# EAGLE schematic FrequencyCounter (EAGLE 7.2.0)
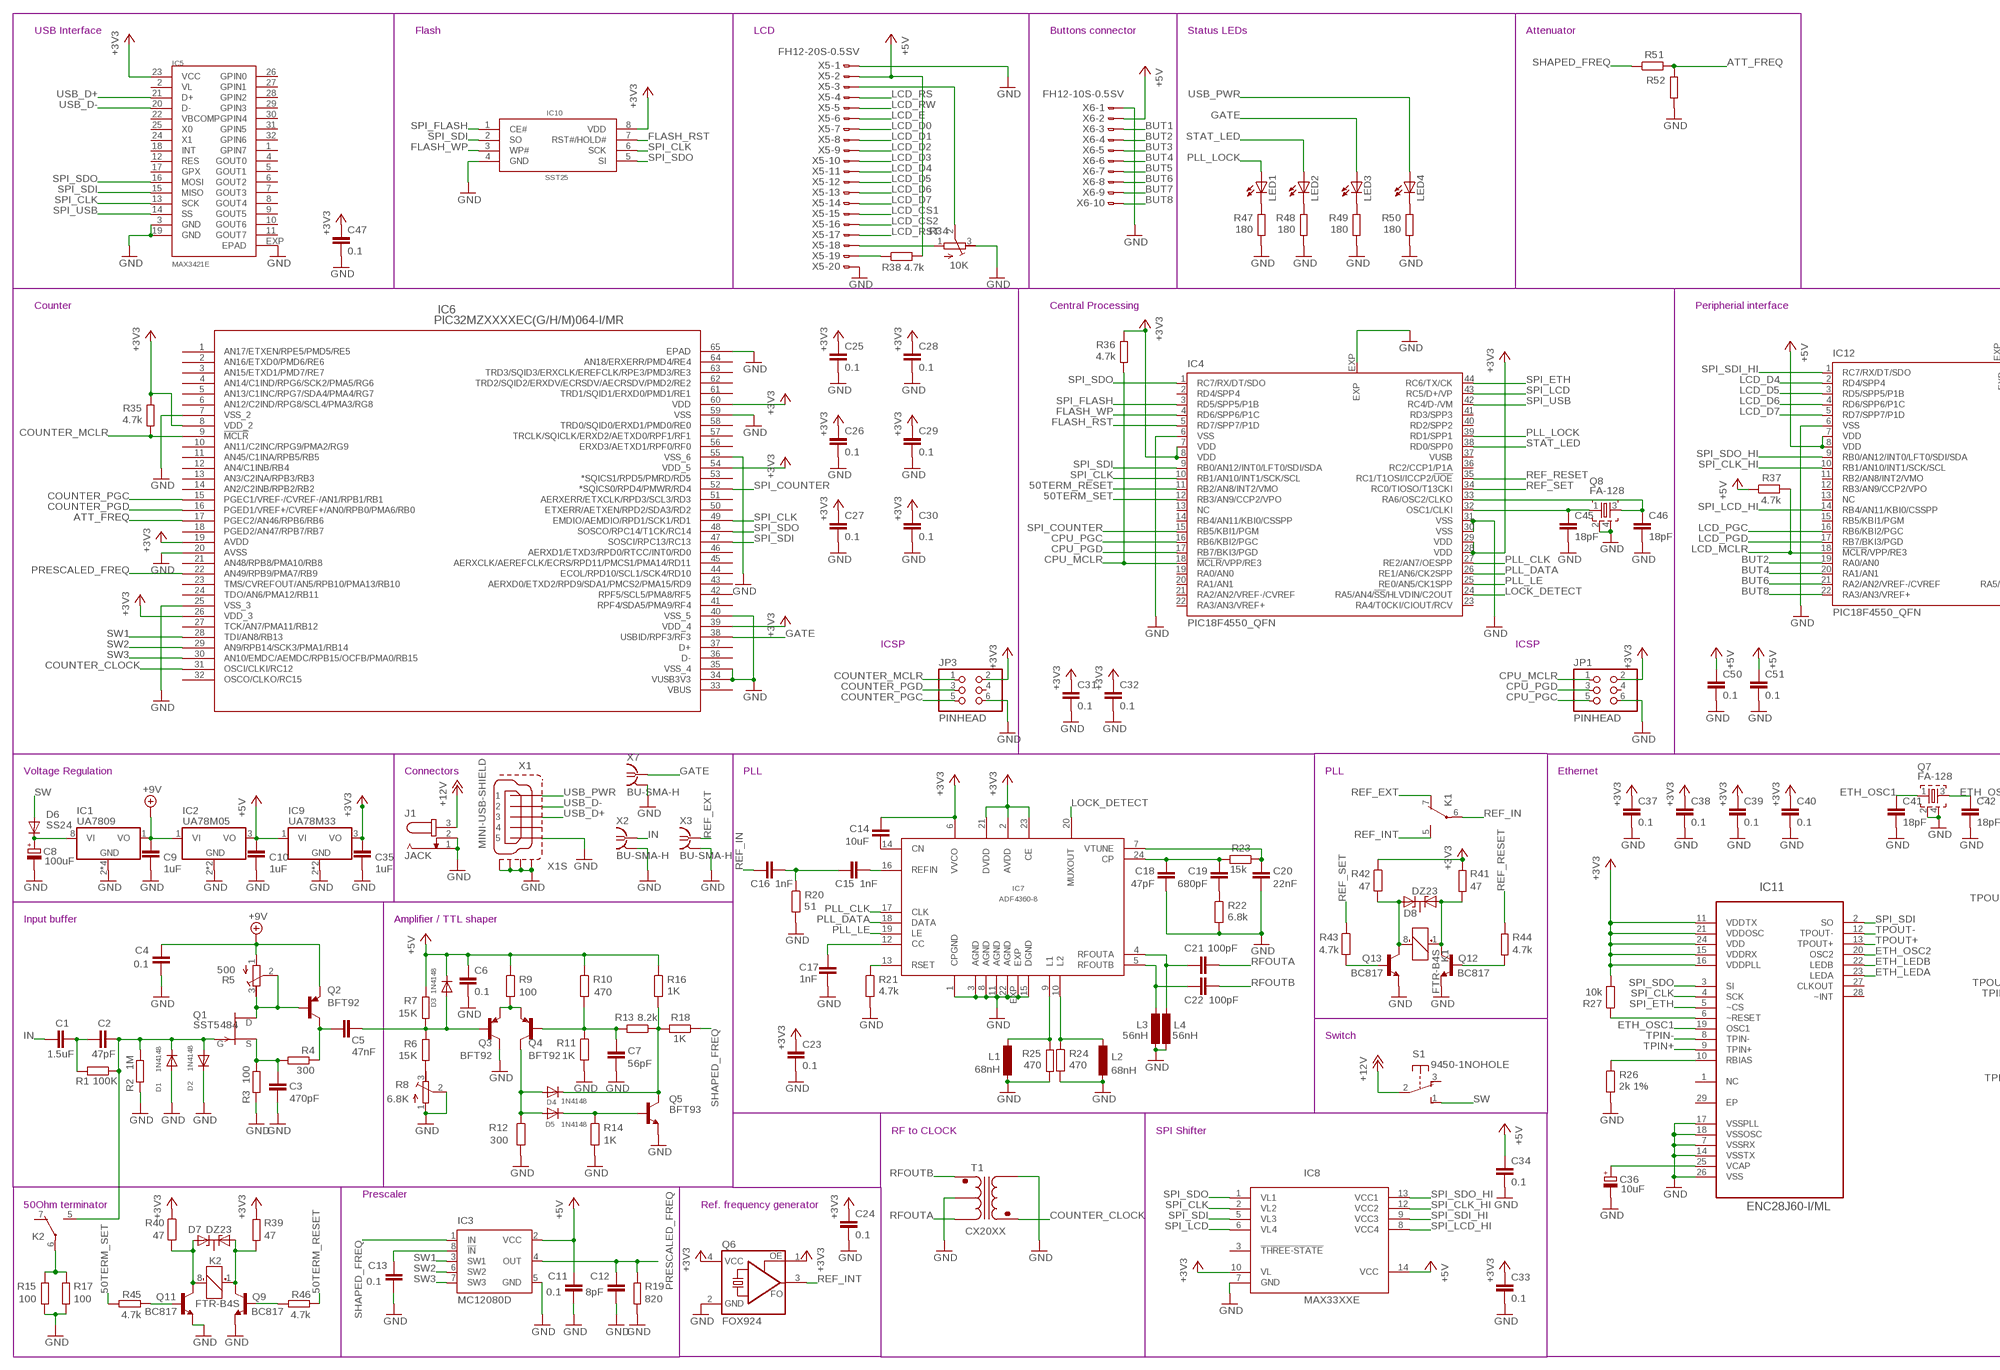
[diagram p0: schematic, sheet 1, part 1 of 2]
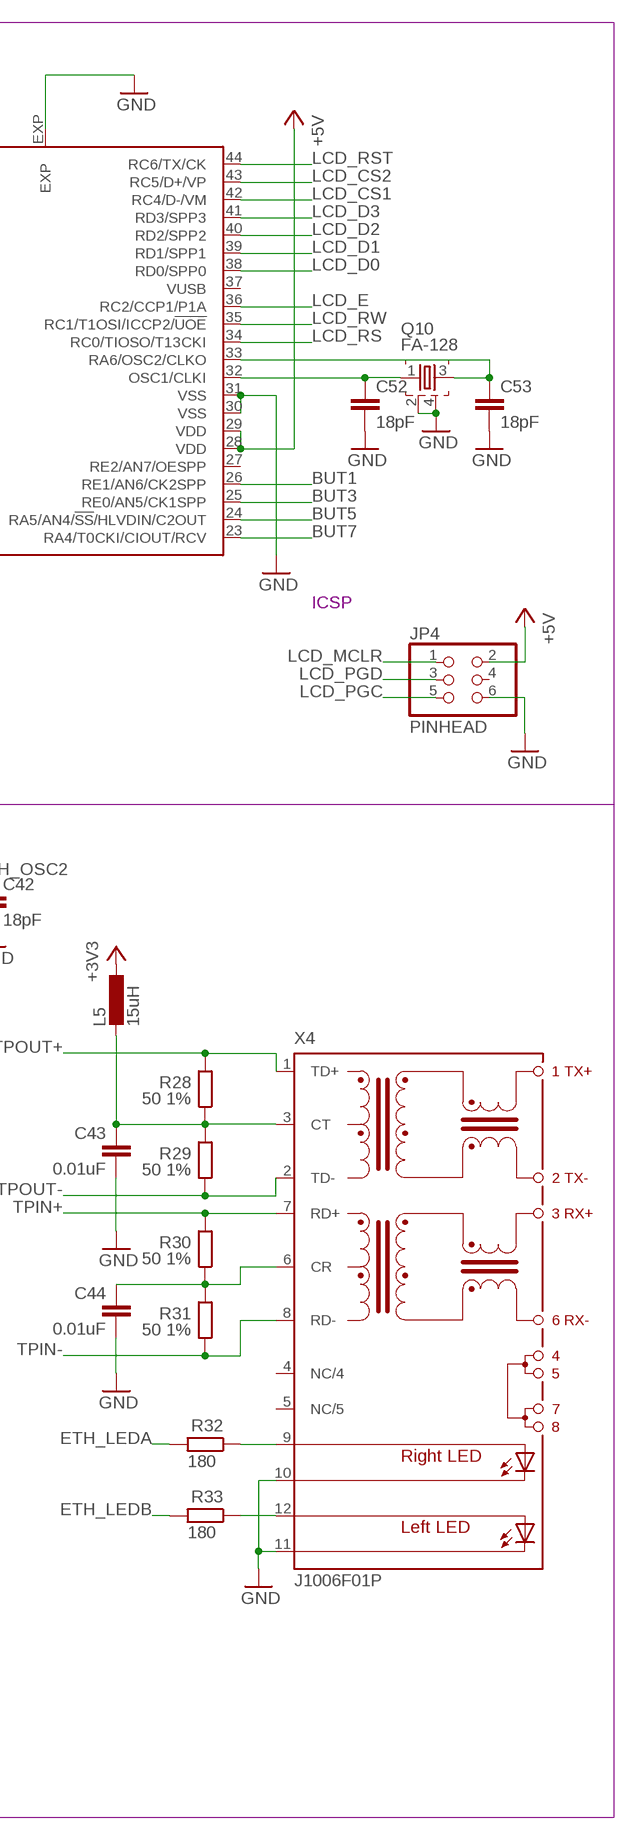
[diagram p1: schematic, sheet 1, part 2 of 2]

## Parts
C1  1.5uF  C-EUC0603  [C0603]
C2  47pF  C-EUC0603  [C0603]
C3  470pF  C-EUC0603  [C0603]
C4  0.1  C-EUC0603  [C0603]
C5  47nF  C-EUC0603  [C0603]
C6  0.1  C-EUC0603  [C0603]
C7  56pF  C-EUC0603  [C0603]
C8  100uF  CPOL-EUD/7343-31R  [D/7343-31R]
C9  1uF  C-EUC0603  [C0603]
C10  1uF  C-EUC0603  [C0603]
C11  0.1  C-EUC0603  [C0603]
C12  8pF  C-EUC0603  [C0603]
C13  0.1  C-EUC0603  [C0603]
C14  10uF  C-EUC0603  [C0603]
C15  1nF  C-EUC0603  [C0603]
C16  1nF  C-EUC0603  [C0603]
C17  1nF  C-EUC0603  [C0603]
C18  47pF  C-EUC0603  [C0603]
C19  680pF  C-EUC0603  [C0603]
C20  22nF  C-EUC0603  [C0603]
C21  100pF  C-EUC0603  [C0603]
C22  100pF  C-EUC0603  [C0603]
C23  0.1  C-EUC0603  [C0603]
C24  0.1  C-EUC0603  [C0603]
C25  0.1  C-EUC0603  [C0603]
C26  0.1  C-EUC0603  [C0603]
C27  0.1  C-EUC0603  [C0603]
C28  0.1  C-EUC0603  [C0603]
C29  0.1  C-EUC0603  [C0603]
C30  0.1  C-EUC0603  [C0603]
C31  0.1  C-EUC0603  [C0603]
C32  0.1  C-EUC0603  [C0603]
C33  0.1  C-EUC0603  [C0603]
C34  0.1  C-EUC0603  [C0603]
C35  1uF  C-EUC0603  [C0603]
C36  10uF  CPOL-EUB/3528-21R  [B/3528-21R]
C37  0.1  C-EUC0603  [C0603]
C38  0.1  C-EUC0603  [C0603]
C39  0.1  C-EUC0603  [C0603]
C40  0.1  C-EUC0603  [C0603]
C41  18pF  C-EUC0603  [C0603]
C42  18pF  C-EUC0603  [C0603]
C43  0.01uF  C-EUC0603  [C0603]
C44  0.01uF  C-EUC0603  [C0603]
C45  18pF  C-EUC0603  [C0603]
C46  18pF  C-EUC0603  [C0603]
C47  0.1  C-EUC0603  [C0603]
C50  0.1  C-EUC0603  [C0603]
C51  0.1  C-EUC0603  [C0603]
C52  18pF  C-EUC0603  [C0603]
C53  18pF  C-EUC0603  [C0603]
D1  1N4148  DIODESOD-123  [SOD-123]
D2  1N4148  DIODESOD-123  [SOD-123]
D3  1N4148  DIODESOD-123  [SOD-123]
D4  1N4148  DIODESOD-123  [SOD-123]
D5  1N4148  DIODESOD-123  [SOD-123]
D6  SS24  DIODE-DO214AA  [DO214AA]
D7  DZ23  [SOT23]
D8  DZ23  [SOT23]
IC1  UA7809  UA78XX  [SOIC8]
IC2  UA78M05  UA78MXX  [SOT223]
IC3  MC12080D  [SO08]
IC4  PIC18F4550_QFN  [QFN44ML8X8]
IC5  MAX3421E  MAX3421ETQFN32  [TQFN32]
IC6  PIC32MZXXXXEC(G/H/M)064-I/MR  [QFN64_9X9MC]
IC7  ADF4360-8  ADF4360  [LFCSP24]
IC8  MAX33XXE  [TSSOP14]
IC9  UA78M33  UA78MXX  [SOT223]
IC10  SST25  [SOIC8]
IC11  ENC28J60-I/ML  [QFN65P600X600X100-29N]
IC12  PIC18F4550_QFN  [QFN44ML8X8]
J1  JACK  JACK-PLUG0  [SPC4077]
JP1  PINHEAD  PINHD-2X32X03/1.27MM  [2X03_1.27]
JP3  PINHEAD  PINHD-2X32X03/1.27MM  [2X03_1.27]
JP4  PINHEAD  PINHD-2X32X03/1.27MM  [2X03_1.27]
K1  FTR-B4S  [FTR-B4S]
K2  FTR-B4S  [FTR-B4S]
L1  68nH  L-EUL2012C  [L2012C]
L2  68nH  L-EUL2012C  [L2012C]
L3  56nH  L-EUL2012C  [L2012C]
L4  56nH  L-EUL2012C  [L2012C]
L5  15uH  L-EUL2012C  [L2012C]
LED1  LEDCHIP-LED0805  [CHIP-LED0805]
LED2  LEDCHIP-LED0805  [CHIP-LED0805]
LED3  LEDCHIP-LED0805  [CHIP-LED0805]
LED4  LEDCHIP-LED0805  [CHIP-LED0805]
Q1  SST5484  [SOT23]
Q2  BFT92  BC807-16-PNP-SOT23-BEC  [SOT23-BEC]
Q3  BFT92  BC807-16-PNP-SOT23-BEC  [SOT23-BEC]
Q4  BFT92  BC807-16-PNP-SOT23-BEC  [SOT23-BEC]
Q5  BFT93  BC808-NPN-SOT23-BEC  [SOT23-BEC]
Q6  FOX924  [FOX924]
Q7  FA-128  [FA-128]
Q8  FA-128  [FA-128]
Q9  BC817  BC817-16-NPN-SOT23-BEC  [SOT23-BEC]
Q10  FA-128  [FA-128]
Q11  BC817  BC817-16-NPN-SOT23-BEC  [SOT23-BEC]
Q12  BC817  BC817-16-NPN-SOT23-BEC  [SOT23-BEC]
Q13  BC817  BC817-16-NPN-SOT23-BEC  [SOT23-BEC]
R1  100K  R-EU_R0603  [R0603]
R2  1M  R-EU_R0603  [R0603]
R3  100  R-EU_R0603  [R0603]
R4  300  R-EU_R0603  [R0603]
R5  500  R-TRIMM4G/J  [RTRIM4G/J]
R6  15K  R-EU_R0603  [R0603]
R7  15K  R-EU_R0603  [R0603]
R8  6.8K  R-TRIMM4G/J  [RTRIM4G/J]
R9  100  R-EU_R0603  [R0603]
R10  470  R-EU_R0603  [R0603]
R11  1K  R-EU_R0603  [R0603]
R12  300  R-EU_R0603  [R0603]
R13  8.2k  R-EU_R0603  [R0603]
R14  1K  R-EU_R0603  [R0603]
R15  100  R-EU_R0603  [R0603]
R16  1K  R-EU_R0603  [R0603]
R17  100  R-EU_R0603  [R0603]
R18  1K  R-EU_R0603  [R0603]
R19  820  R-EU_R0603  [R0603]
R20  51  R-EU_R0603  [R0603]
R21  4.7k  R-EU_R0603  [R0603]
R22  6.8k  R-EU_R0603  [R0603]
R23  15k  R-EU_R0603  [R0603]
R24  470  R-EU_R0603  [R0603]
R25  470  R-EU_R0603  [R0603]
R26  2k 1%  R-EU_R0603  [R0603]
R27  10k  R-EU_R0603  [R0603]
R28  50 1%  R-EU_R0603  [R0603]
R29  50 1%  R-EU_R0603  [R0603]
R30  50 1%  R-EU_R0603  [R0603]
R31  50 1%  R-EU_R0603  [R0603]
R32  180  R-EU_R0603  [R0603]
R33  180  R-EU_R0603  [R0603]
R34  10K  R-TRIMM4G/J  [RTRIM4G/J]
R35  4.7k  R-EU_R0603  [R0603]
R36  4.7k  R-EU_R0603  [R0603]
R37  4.7k  R-EU_R0603  [R0603]
R38  4.7k  R-EU_R0603  [R0603]
R39  47  R-EU_R0603  [R0603]
R40  47  R-EU_R0603  [R0603]
R41  47  R-EU_R0603  [R0603]
R42  47  R-EU_R0603  [R0603]
R43  4.7k  R-EU_R0603  [R0603]
R44  4.7k  R-EU_R0603  [R0603]
R45  4.7k  R-EU_R0603  [R0603]
R46  4.7k  R-EU_R0603  [R0603]
R47  180  R-EU_R0603  [R0603]
R48  180  R-EU_R0603  [R0603]
R49  180  R-EU_R0603  [R0603]
R50  180  R-EU_R0603  [R0603]
R51  R-EU_R0603  [R0603]
R52  R-EU_R0603  [R0603]
S1  9450-1NOHOLE  [9450-1-NOHOLE]
T1  CX20XX  [PULSE_CX20]
X1  MINI-USB-SHIELD  MINI-USB-SHIELD-UX60A-MB-5ST  [UX60A-MB-5ST]
X2  BU-SMA-H  [BU-SMA-H]
X3  BU-SMA-H  [BU-SMA-H]
X4  J1006F01P  [J1]
X5  FH12-20S-0.5SV  [FH12-20S-0.5SV]
X6  FH12-10S-0.5SV  [FH12-10S-0.5SV]
X7  BU-SMA-H  [BU-SMA-H]

## Nets
50TERM_RESET: IC4.11(RB2/AN8/INT2/VMO) R46.2
50TERM_SET: IC4.12(RB3/AN9/CCP2/VPO) R45.1
+3V3: C14.2 C23.1 C24.1 C25.1 C26.1 C27.1 C28.1 C29.1 C30.1 C31.1 C32.1 C33.1 C35.1 C37.1 C38.1 C39.1 C40.1 C47.1 IC4.7(VDD) IC4.8(VDD) IC4.28(VDD) IC4.29(VDD) IC5.23(VCC) IC6.8(VDD_2) IC6.19(AVDD) IC6.26(VDD_3) IC6.39(VDD_4) IC6.54(VDD_5) IC6.60(VDD) IC7.2(AVDD) IC7.6(VVCO) IC7.21(DVDD) IC7.23(CE) IC8.10(VL) IC9.3(VO) IC10.8(VDD) IC11.11(VDDTX) IC11.15(VDDRX) IC11.16(VDDPLL) IC11.21(VDDOSC) IC11.24(VDD) JP1.2 JP3.2 L5.1 Q6.1(OE) Q6.4(VCC) R27.2 R35.1 R36.1 R39.1 R40.1 R41.1 R42.1
+5V: C6.1 C10.1 C11.1 C34.1 C50.1 C51.1 D3.C IC2.3(VO) IC3.2(VCC) IC8.14(VCC) IC9.1(VI) IC12.7(VDD) IC12.8(VDD) IC12.28(VDD) IC12.29(VDD) JP4.2 R7.1 R9.1 R10.1 R16.1 R37.1 R38.2 X5.2 X6.2
+9V: C4.1 C9.1 IC1.1(VO) IC2.1(VI) Q2.E R5.1(A)
+12V: J1.3 S1.2(P)
ATT_FREQ: IC6.17(PGEC2/AN46/RPB6/RB6) R51.2 R52.1
BUT1: IC12.26(RE1/AN6/CK2SPP) X6.3
BUT2: IC12.19(RA0/AN0) X6.4
BUT3: IC12.25(RE0/AN5/CK1SPP) X6.5
BUT4: IC12.20(RA1/AN1) X6.6
BUT5: IC12.24(RA5/AN4/!SS!/HLVDIN/C2OUT) X6.7
BUT6: IC12.21(RA2/AN2/VREF-/CVREF) X6.8
BUT7: IC12.23(RA4/T0CKI/CIOUT/RCV) X6.9
BUT8: IC12.22(RA3/AN3/VREF+) X6.10
COUNTER_CLOCK: IC6.31(OSCI/CLKI/RC12) T1.P$4
COUNTER_MCLR: IC6.9(!MCLR!) JP3.1 R35.2
COUNTER_PGC: IC6.15(PGEC1/VREF-/CVREF-/AN1/RPB1/RB1) JP3.5
COUNTER_PGD: IC6.16(PGED1/VREF+/CVREF+/AN0/RPB0/PMA6/RB0) JP3.3
CPU_MCLR: IC4.18(!MCLR!/VPP/RE3) JP1.1 R36.2
CPU_PGC: IC4.16(RB6/KBI2/PGC) JP1.5
CPU_PGD: IC4.17(RB7/BKI3/PGD) JP1.3
ETH_LEDA: IC11.23(LEDA) R32.2
ETH_LEDB: IC11.22(LEDB) R33.2
ETH_OSC1: C41.1 IC11.19(OSC1) Q7.1
ETH_OSC2: C42.1 IC11.20(OSC2) Q7.3
FLASH_RST: IC4.5(RD7/SPP7/P1D) IC10.7(RST#/HOLD#)
FLASH_WP: IC4.4(RD6/SPP6/P1C) IC10.3(WP#)
GATE: IC6.38(USBID/RPF3/RF3) LED3.A X7.1
GND: C3.2 C4.2 C6.2 C7.1 C8.- C9.2 C10.2 C11.2 C12.2 C13.2 C17.2 C18.1 C20.1 C23.2 C24.2 C25.2 C26.2 C27.2 C28.2 C29.2 C30.2 C31.2 C32.2 C33.2 C34.2 C35.2 C36.- C37.2 C38.2 C39.2 C40.2 C41.2 C42.2 C43.2 C44.2 C45.2 C46.2 C47.2 C50.2 C51.2 C52.2 C53.2 D1.A D2.C IC1.2(GND) IC1.3(GND) IC1.6(GND) IC1.7(GND) IC2.2(GND) IC2.4(GND) IC3.5(GND) IC4.6(VSS) IC4.30(VSS) IC4.31(VSS) IC4.EXP IC5.3(GND) IC5.19(GND) IC5.EXP(EPAD) IC6.7(VSS_2) IC6.20(AVSS) IC6.25(VSS_3) IC6.34(VUSB3V3) IC6.35(VSS_4) IC6.40(VSS_5) IC6.55(VSS_6) IC6.59(VSS) IC6.65(EPAD) IC7.1(CPGND) IC7.3(AGND) IC7.8(AGND) IC7.11(AGND) IC7.15(DGND) IC7.22(AGND) IC7.EXP IC8.7(GND) IC9.2(GND) IC9.4(GND) IC10.4(GND) IC11.7(VSSRX) IC11.14(VSSTX) IC11.17(VSSPLL) IC11.18(VSSOSC) IC11.26(VSS) IC12.6(VSS) IC12.30(VSS) IC12.31(VSS) IC12.EXP J1.1 J1.2 JP1.6 JP3.6 JP4.6 L1.2 L2.2 L3.2 L4.2 Q3.C Q5.E Q6.2(GND) Q7.2 Q7.4 Q8.2 Q8.4 Q9.E Q10.2 Q10.4 Q11.E Q12.E Q13.E R2.2 R3.2 R8.1(A) R8.2(S) R11.2 R12.2 R14.2 R15.2 R17.2 R19.2 R20.2 R21.2 R22.2 R24.2 R25.2 R26.2 R34.3(E) R47.2 R48.2 R49.2 R50.2 R52.2 T1.P$2 T1.P$6 X1.5 X1.M1(S1) X1.M2(S2) X1.M3(S3) X1.M4(S4) X2.2 X2.3 X2.4 X2.5 X3.2 X3.3 X3.4 X3.5 X4.10(C-R) X4.11(C-L) X5.1 X5.20 X6.1 X7.2 X7.3 X7.4 X7.5
IN: C1.1 X2.1
LCD_CS1: IC12.42(RC4/D-/VM) X5.15
LCD_CS2: IC12.43(RC5/D+/VP) X5.16
LCD_D0: IC12.38(RD0/SPP0) X5.7
LCD_D1: IC12.39(RD1/SPP1) X5.8
LCD_D2: IC12.40(RD2/SPP2) X5.9
LCD_D3: IC12.41(RD3/SPP3) X5.10
LCD_D4: IC12.2(RD4/SPP4) X5.11
LCD_D5: IC12.3(RD5/SPP5/P1B) X5.12
LCD_D6: IC12.4(RD6/SPP6/P1C) X5.13
LCD_D7: IC12.5(RD7/SPP7/P1D) X5.14
LCD_E: IC12.36(RC2/CCP1/P1A) X5.6
LCD_MCLR: IC12.18(!MCLR!/VPP/RE3) JP4.1 R37.2
LCD_PGC: IC12.16(RB6/KBI2/PGC) JP4.5
LCD_PGD: IC12.17(RB7/BKI3/PGD) JP4.3
LCD_RS: IC12.34(RC0/TIOSO/T13CKI) X5.4
LCD_RST: IC12.44(RC6/TX/CK) X5.17
LCD_RW: IC12.35(RC1/T1OSI/ICCP2/!UOE) X5.5
LOCK_DETECT: IC4.24(RA5/AN4/!SS!/HLVDIN/C2OUT) IC7.20(MUXOUT)
N$1: C2.2 D1.C D2.A K2.5(-2:S) Q1.3(G) R1.1 R2.1
N$2: C1.2 C2.1 R1.2
N$3: C3.1 Q1.2(S) R3.1 R4.2
N$4: Q1.1(D) Q2.B R5.2(S) R5.3(E)
N$5: C5.2 Q2.C R4.1
N$6: R6.2 R8.3(E)
N$7: C5.1 D3.A Q3.B R6.1 R7.2
N$8: Q3.E Q4.E R9.2
N$9: C7.2 Q4.B R10.2 R11.1 R13.2
N$10: D4.A D5.A Q4.C R12.1
N$11: D4.C Q5.C R13.1 R16.2 R18.2
N$12: D5.C Q5.B R14.1
N$13: C8.+ D6.C IC1.8(VI)
N$14: K2.6(-2:P) R15.1 R17.1
N$15: C14.1 IC7.14(CN)
N$16: C13.1 IC3.8(!IN)
N$17: C15.1 IC7.16(REFIN)
N$18: C15.2 C16.1 R20.1
N$19: C17.1 IC7.12(CC)
N$20: IC7.13(RSET) R21.1
N$21: C19.1 R22.1
N$22: C21.1 IC7.4(RFOUTA) L4.1
N$23: C20.2 IC7.7(VTUNE) R23.1
N$24: C18.2 C19.2 IC7.24(CP) R23.2
N$25: C22.2 IC7.5(RFOUTB) L3.1
N$26: IC7.10(L2) L2.1 R24.1
N$27: IC7.9(L1) L1.1 R25.1
N$28: C53.1 IC12.33(RA6/OSC2/CLKO) Q10.3
N$29: C46.1 IC4.33(RA6/OSC2/CLKO) Q8.3
N$30: C45.1 IC4.32(OSC1/CLKI) Q8.1
N$31: C36.+ IC11.25(VCAP)
N$32: IC11.10(RBIAS) R26.1
N$33: C43.1 L5.2 R28.1 R29.2 X4.3(CT)
N$34: IC11.6(~RESET) R27.1
N$35: R32.1 X4.9(A-R)
N$36: R33.1 X4.12(A-L)
N$37: C44.1 R30.1 R31.2 X4.6(CR)
N$38: C52.1 IC12.32(OSC1/CLKI) Q10.1
N$39: R34.2(S) X5.3
N$40: R34.1(A) X5.18
N$41: R38.1 X5.19
N$42: D7.2(A2) K2.8(K:-) Q11.C R40.2
N$43: D8.2(A2) K1.8(K:-) Q13.C R42.2
N$44: D7.1(A1) K2.1(K:+) Q9.C R39.2
N$45: D8.1(A1) K1.1(K:+) Q12.C R41.2
N$46: Q13.B R43.2
N$47: Q12.B R44.2
N$48: Q11.B R45.2
N$49: Q9.B R46.1
N$50: LED1.C R47.1
N$51: LED2.C R48.1
N$52: LED3.C R49.1
N$54: LED4.C R50.1
PLL_CLK: IC4.27(RE2/AN7/OESPP) IC7.17(CLK)
PLL_DATA: IC4.26(RE1/AN6/CK2SPP) IC7.18(DATA)
PLL_LE: IC4.25(RE0/AN5/CK1SPP) IC7.19(LE)
PLL_LOCK: IC4.39(RD1/SPP1) LED1.A
PRESCALED_FREQ: C12.1 IC3.4(OUT) IC6.22(AN49/RPB9/PMA7/RB9) R19.1
REF_EXT: K1.7(-2:O) X3.1
REF_IN: C16.2 K1.6(-2:P)
REF_INT: K1.5(-2:S) Q6.3(FO)
REF_RESET: IC4.35(RC1/T1OSI/ICCP2/!UOE) R44.1
REF_SET: IC4.34(RC0/TIOSO/T13CKI) R43.1
RFOUTA: C21.2 T1.P$3
RFOUTB: C22.1 T1.P$1
SHAPED_FREQ: IC3.1(IN) R18.1 R51.1
SPI_CLK: IC4.10(RB1/AN10/INT1/SCK/SCL) IC5.13(SCK) IC6.49(EMDIO/AEMDIO/RPD1/SCK1/RD1) IC8.2(VL2) IC10.6(SCK) IC11.4(SCK)
SPI_CLK_HI: IC8.12(VCC2) IC12.10(RB1/AN10/INT1/SCK/SCL)
SPI_COUNTER: IC4.15(RB5/KBI1/PGM) IC6.52(*SQICS0/RPD4/PMWR/RD4)
SPI_ETH: IC4.44(RC6/TX/CK) IC11.5(~CS)
SPI_FLASH: IC4.3(RD5/SPP5/P1B) IC10.1(CE#)
SPI_LCD: IC4.43(RC5/D+/VP) IC8.6(VL4)
SPI_LCD_HI: IC8.8(VCC4) IC12.14(RB4/AN11/KBI0/CSSPP)
SPI_SDI: IC4.9(RB0/AN12/INT0/LFT0/SDI/SDA) IC5.15(MISO) IC6.47(SOSCI/RPC13/RC13) IC8.5(VL3) IC10.2(SO) IC11.2(SO)
SPI_SDI_HI: IC8.9(VCC3) IC12.1(RC7/RX/DT/SDO)
SPI_SDO: IC4.1(RC7/RX/DT/SDO) IC5.16(MOSI) IC6.48(SOSCO/RPC14/T1CK/RC14) IC8.1(VL1) IC10.5(SI) IC11.3(SI)
SPI_SDO_HI: IC8.13(VCC1) IC12.9(RB0/AN12/INT0/LFT0/SDI/SDA)
SPI_USB: IC4.42(RC4/D-/VM) IC5.14(SS)
STAT_LED: IC4.38(RD0/SPP0) LED2.A
SW: D6.A S1.1(S)
SW1: IC3.3(SW1) IC6.28(TDI/AN8/RB13)
SW2: IC3.6(SW2) IC6.29(AN9/RPB14/SCK3/PMA1/RB14)
SW3: IC3.7(SW3) IC6.30(AN10/EMDC/AEMDC/RPB15/OCFB/PMA0/RB15)
TPIN+: IC11.9(TPIN+) R30.2 X4.7(RD+)
TPIN-: IC11.8(TPIN-) R31.1 X4.8(RD-)
TPOUT+: IC11.13(TPOUT+) R28.2 X4.1(TD+)
TPOUT-: IC11.12(TPOUT-) R29.1 X4.2(TD-)
USB_D+: IC5.21(D+) X1.3
USB_D-: IC5.20(D-) X1.2
USB_PWR: LED4.A X1.1
Unconnected: D7.3(C) D8.3(C) IC4.2(RD4/SPP4) IC4.13(NC) IC4.14(RB4/AN11/KBI0/CSSPP) IC4.19(RA0/AN0) IC4.20(RA1/AN1) IC4.21(RA2/AN2/VREF-/CVREF) IC4.22(RA3/AN3/VREF+) IC4.23(RA4/T0CKI/CIOUT/RCV) IC4.36(RC2/CCP1/P1A) IC4.37(VUSB) IC4.40(RD2/SPP2) IC4.41(RD3/SPP3) IC5.1(GPIN7) IC5.2(VL) IC5.4(GOUT0) IC5.5(GOUT1) IC5.6(GOUT2) IC5.7(GOUT3) IC5.8(GOUT4) IC5.9(GOUT5) IC5.10(GOUT6) IC5.11(GOUT7) IC5.12(RES) IC5.17(GPX) IC5.18(INT) IC5.22(VBCOMP) IC5.24(X1) IC5.25(X0) IC5.26(GPIN0) IC5.27(GPIN1) IC5.28(GPIN2) IC5.29(GPIN3) IC5.30(GPIN4) IC5.31(GPIN5) IC5.32(GPIN6) IC6.1(AN17/ETXEN/RPE5/PMD5/RE5) IC6.2(AN16/ETXD0/PMD6/RE6) IC6.3(AN15/ETXD1/PMD7/RE7) IC6.4(AN14/C1IND/RPG6/SCK2/PMA5/RG6) IC6.5(AN13/C1INC/RPG7/SDA4/PMA4/RG7) IC6.6(AN12/C2IND/RPG8/SCL4/PMA3/RG8) IC6.10(AN11/C2INC/RPG9/PMA2/RG9) IC6.11(AN45/C1INA/RPB5/RB5) IC6.12(AN4/C1INB/RB4) IC6.13(AN3/C2INA/RPB3/RB3) IC6.14(AN2/C2INB/RPB2/RB2) IC6.18(PGED2/AN47/RPB7/RB7) IC6.21(AN48/RPB8/PMA10/RB8) IC6.23(TMS/CVREFOUT/AN5/RPB10/PMA13/RB10) IC6.24(TDO/AN6/PMA12/RB11) IC6.27(TCK/AN7/PMA11/RB12) IC6.32(OSCO/CLKO/RC15) IC6.36(D-) IC6.37(D+) IC6.41(RPF4/SDA5/PMA9/RF4) IC6.42(RPF5/SCL5/PMA8/RF5) IC6.43(AERXD0/ETXD2/RPD9/SDA1/PMCS2/PMA15/RD9) IC6.44(ECOL/RPD10/SCL1/SCK4/RD10) IC6.45(AERXCLK/AEREFCLK/ECRS/RPD11/PMCS1/PMA14/RD11) IC6.46(AERXD1/ETXD3/RPD0/RTCC/INT0/RD0) IC6.50(ETXERR/AETXEN/RPD2/SDA3/RD2) IC6.51(AERXERR/ETXCLK/RPD3/SCL3/RD3) IC6.53(*SQICS1/RPD5/PMRD/RD5) IC6.56(ERXD3/AETXD1/RPF0/RF0) IC6.57(TRCLK/SQICLK/ERXD2/AETXD0/RPF1/RF1) IC6.58(TRD0/SQID0/ERXD1/PMD0/RE0) IC6.61(TRD1/SQID1/ERXD0/PMD1/RE1) IC6.62(TRD2/SQID2/ERXDV/ECRSDV/AECRSDV/PMD2/RE2) IC6.63(TRD3/SQID3/ERXCLK/EREFCLK/RPE3/PMD3/RE3) IC6.64(AN18/ERXERR/PMD4/RE4) IC8.3(!THREE-STATE!) IC11.1(NC) IC11.27(CLKOUT) IC11.28(~INT) IC11.29(EP) IC12.11(RB2/AN8/INT2/VMO) IC12.12(RB3/AN9/CCP2/VPO) IC12.13(NC) IC12.15(RB5/KBI1/PGM) IC12.27(RE2/AN7/OESPP) IC12.37(VUSB) JP1.4 JP3.4 JP4.4 K1.2(-1:O) K1.3(-1:P) K1.4(-1:S) K2.2(-1:O) K2.3(-1:P) K2.4(-1:S) K2.7(-2:O) S1.3(O) X1.4 X4.4(NC/4) X4.5(NC/5)

## Notes on the sheet
- USB Interface | Flash | LCD | Buttons connector | Status LEDs | Attenuator
- Counter | Central Processing | Peripherial interface
- ICSP
- ICSP | ICSP
- Voltage Regulation | Connectors | PLL | PLL | Ethernet
- Input buffer | Amplifier / TTL shaper
- Switch
- RF to CLOCK | SPI Shifter
- Prescaler
- 50Ohm terminator | Ref. frequency generator

## Power pins joined to a net without a drawn wire
VBUS: IC6.33(VBUS)

## Library data of the parts
C1-C7 C9-C35 C37-C47 C50-C53 = rcl:C-EU: CAPACITOR, European symbol
C8 C36 = rcl:CPOL-EU: POLARIZED CAPACITOR, European symbol
D1-D5 = adafruit:DIODE: Diode SMADIODE - SMA Surface Mount Package 20V 1A Schottky Diode Digikey: 641-1014-6-ND DO-1N4148 - Through Hole Small Current Diode SOD-123 20V 1 A (.5mV Vf) Schottky Diode - Digikey: MBRX120TPMSCT-ND SOD-323 10V 570mA (.38mV Vf, 3ns) Schottky Diode - Digikey: ZLLS410CT-ND SOD-523 30V 30mA Schottky Diode (RB751S-40TE61) - Digikey: RB751S-40TE61CT-ND SOT23-R/W - SOT23 Package (R = Solder Paste/Reflow Ovens, W = Hand-Soldering) BAT54Film 40V 300mA - Digikey: 497-7162-1-ND
D6 = diode:DIODE-: DIODE
D7 D8 = own-collection:DZ23
IC1 = own-collection:UA78XX
IC2 IC9 = own-collection:UA78MXX
IC3 = on-semiconductor:MC12080: 1.1 GHz Prescaler MECL PLL COMPONENTS ÷10/20/40/80 PRESCALER Source: http://motorola.com/sps .. MC12080.pdf; MF: ON SEMICONDUCTOR; MPN: MC12080D; OC_FARNELL: 1607924; OC_NEWARK: 40C2542
IC4 IC12 = own-collection:PIC18F4*_QFN: USB Microcontrollers with nanoWatt Technology High-Performance, Enhanced Flash, 28/40/44-Pin, Source: http://ww1.microchip.com/downloads/en/devicedoc/39632c.pdf; MF: MICROCHIP; MPN: PIC18F4550-I/ML; OC_FARNELL: 1292276; OC_NEWARK: 08J9631
IC5 = own-collection:MAX3421E: USB Peripheral/Host Controller w/ SPI
IC6 = own-collection:PIC32MZXXXXEC(G/H/M)064-I/MR; MANUFACTURER_PART_NUMBER: pic32mz1024ecg064-i/mr; VENDOR: Microchip
IC7 = own-collection:ADF4360: ADF4360 familiy Integrated Synthesizer and VCO
IC8 = own-collection:MAX33XXE: MAX3372E–MAX3379E/MAX3390E–MAX3393E
IC10 = own-collection:SST25: SST25 series 64 Mbit SPI Serial Dual I/O Flash
IC11 = own-collection:ENC28J60-I/ML: IC ETHERNET CTRLR W/SPI; DESCRIPTION: IC ETHERNET CTRLR W/SPI; MPN: ENC28J60-I/ML; OC_FARNELL: 1564400; OC_NEWARK: 71J3843; PACKAGE: QFN-28; SUPPLIER: Microchip
J1 = con-jack:JACK-PLUG: DC POWER JACK Power Jack, DC, Right Angle, Through Hole, Rated 5A at 16VDC, PC Terminals Distributor: Farnell (www.Farnell.de) Drawing: 84N1161.pdf / 84N1162.pdf Manufacturer: SPC Technology (www.spctechnology.com) Type: SPC4077 / SPC 4078; OC_FARNELL: unknown; OC_NEWARK: unknown
JP1 JP3 JP4 = own-collection:PINHD-2X3: PIN HEADER
K1 K2 = relay:FTR-B4: ULTRA MINIATURE RELAY 2 POLES - 2 A (Slim Profile Signal Relay) FUJITSU FTR-B4 SERIES Source: FTR-B4.pdf
L1-L4 = rcl:L-EU: INDUCTOR, European symbol
L5 = resistor:L-EU: INDUCTOR, European symbol
LED1-LED4 = adafruit:LED: LED OSRAM: - CHIPLED LG R971, LG N971, LY N971, LG Q971, LY Q971, LO R971, LY R971 LH N974, LH R974 LS Q976, LO Q976, LY Q976 LO Q996 - Hyper CHIPLED LW Q18S LB Q993, LB Q99A, LB R99A - SideLED LS A670, LO A670, LY A670, LG A670, LP A670 LB A673, LV A673, LT A673, LW A673 LH A674 LY A675 LS A676, LA A676, LO A676, LY A676, LW A676 LS A679, LY A679, LG A679 - Hyper Micro SIDELED® LS Y876, LA Y876, LO Y876, LY Y876 LT Y87S - SmartLED LW L88C, LW L88S LB L89C, LB L89S, LG L890 LS L89K, LO L89K, LY L89K LS L896, LA L896, LO L896, LY L896 - TOPLED LS T670, LO T670, LY T670, LG T670, LP T670 LSG T670, LSP T670, LSY T670, LOP T670, LYG T670 LG T671, LOG T671, LSG T671 LB T673, LV T673, LT T673, LW T673 LH T674 LS T676, LA T676, LO T676, LY T676, LB T676, LH T676, LSB T676, LW T676 LB T67C, LV T67C, LT T67C, LS T67K, LO T67K, LY T67K, LW E67C LS E67B, LA E67B, LO E67B, LY E67B, LB E67C, LV E67C, LT E67C LW T67C LS T679, LY T679, LG T679 LS T770, LO T770, LY T770, LG T770, LP T770 LB T773, LV T773, LT T773, LW T773 LH T774 LS E675, LA E675, LY E675, LS T675 LS T776, LA T776, LO T776, LY T776, LB T776 LHGB T686 LT T68C, LB T68C - Hyper Mini TOPLED® LB M676 - Mini TOPLED Santana® LG M470 LS M47K, LO M47K, LY M47K Source: http://www.osram.convergy.de/
Q1 = transistor-fet:?548*: N-Channel JFETs Source: VISHAY 2N5484.pdf Compatible: TO92 2N5245 J304 J305 U310 J308 J309 J310 TO72 2N4416 2N4416A 2N3823 2N4351 3N169 3N170 3N171 MFE3002 TO18 2N3796 2N3797 MFE825 Source: Motorola European Master Guide Pacge 3-59
Q2-Q4 = transistor:*-PNP-: PNP Transistror
Q5 Q9 Q11-Q13 = transistor:*-NPN-: NPN Transistror BF959 corrected 2008.03.06
Q6 = own-collection:FOX924: 3.3V Ultra Miniature SMD HCMOS TCXO/VCTCXO
Q7 Q8 Q10 = crystal:FA-: MHz RANGE CRYSTAL UNIT Source: Epson Toyocom
R1-R4 R6 R7 R9-R33 R35-R52 = rcl:R-EU_: RESISTOR, European symbol
R5 R8 R34 = rcl:R-TRIMM: Trimm resistor
S1 = own-collection:9450-1: MARQUARDT SWITCH
T1 = own-collection:CX20XX
X1 = con-hirose:MINI-USB-SHIELD-: MINI USB Connector Source: http://www.hirose.co.jp/cataloge_hp/e24000019.pdf; OC_FARNELL: unknown; OC_NEWARK: unknown
X2 X3 X7 = con-coax:BU-SMA-H: FEMALE SMA CONNECTOR Radiall; OC_FARNELL: unknown; OC_NEWARK: unknown
X4 = con-pulse:J1006F01P: PULSEJACK (TM) 1x1 Tab-UP RJ45 10/100 Base-TX RJ45 1x1 Tab-UP with LEDs 8-pin (J1 series) and 6-pin (JP series) integrated magnetics connector, designed to support applications, such as ADSL modems, LAN-on-Motherboard, and Hub and Switches. Source: www.pulseeng.com .. PulseJack-J402.pdf; OC_FARNELL: unknown; OC_NEWARK: unknown
X5 = own-collection:FH12-20S-0.5S: 0.5mm Pitch Connectors For FPC/FFC Source: Data sheet <http://www.hirose.co.jp/cataloge_hp/e58605370.pdf>
X6 = own-collection:FH12-10S-0.5S: 0.5mm Pitch Connectors For FPC/FFC Source: Data sheet <http://www.hirose.co.jp/cataloge_hp/e58605370.pdf>